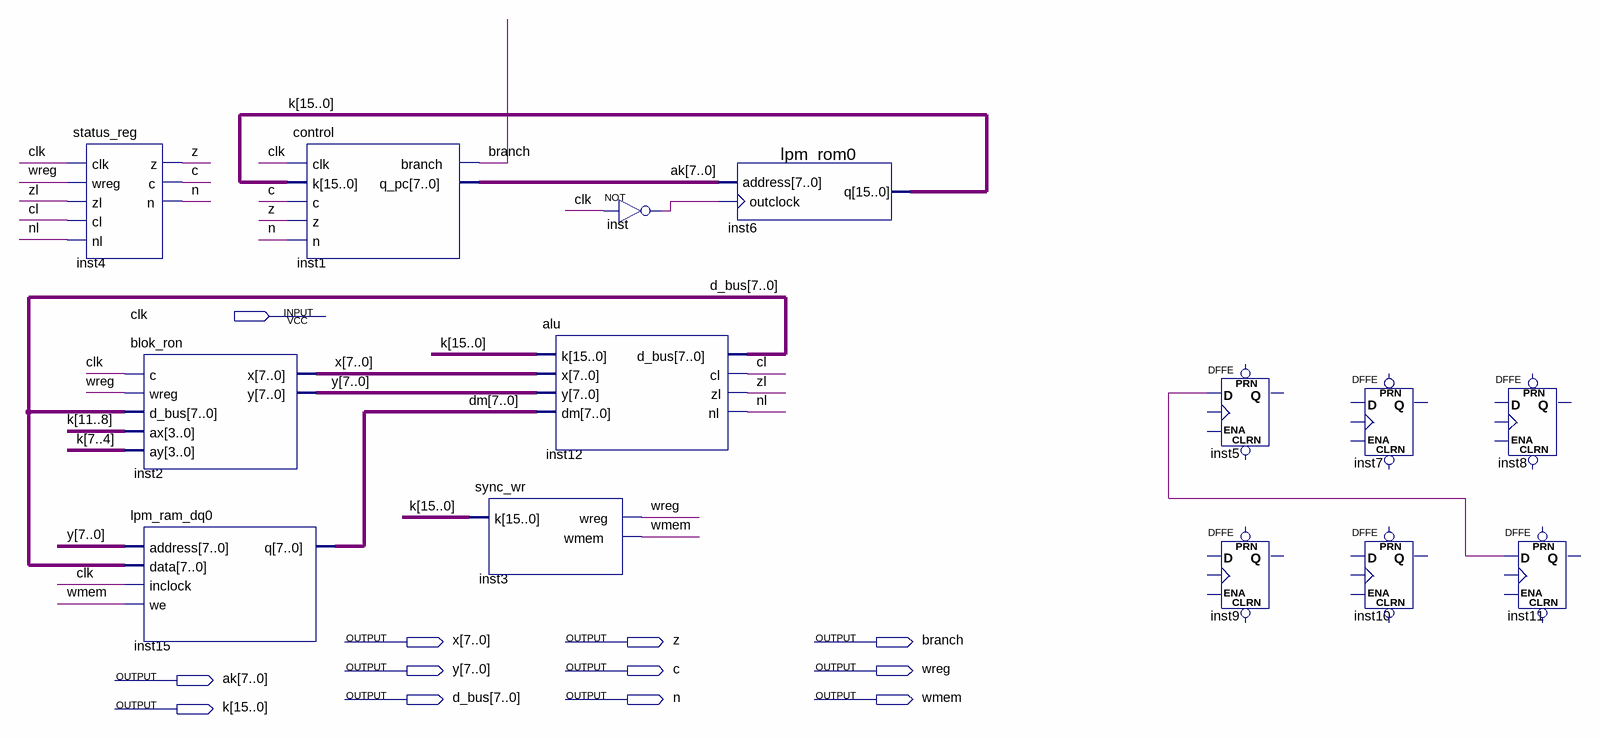
[diagram p0: schematic sheet]
// Quartus schematic cpu.bdf as structural Verilog: 14 symbols, 12 pins
module cpu (
  input  clk,
  output [7:0] x,
  output z,
  output branch,
  output [7:0] y,
  output c,
  output wreg,
  output [7:0] ak,
  output [7:0] d_bus,
  output n,
  output wmem,
  output [15:0] k
);

  wire cl, inst_out, nl, undriven, zl;
  wire [7:0] dm;

  status_reg inst4 (.clk(clk), .wreg(wreg), .zl(zl), .cl(cl), .nl(nl), .z(z), .c(c), .n(n));
  blok_ron inst2 (.c(clk), .wreg(wreg), .d_bus(d_bus), .ax(k[11:8]), .ay(k[7:4]), .x(x), .y(y));
  lpm_ram_dq0 inst15 (.address(y), .data(d_bus), .inclock(clk), .we(wmem), .q(dm));
  control inst1 (.clk(clk), .k(k), .c(c), .z(z), .n(n), .branch(branch), .q_pc(ak));
  sync_wr inst3 (.k(k), .wreg(wreg), .wmem(wmem));
  alu inst12 (.k(k), .x(x), .y(y), .dm(dm), .d_bus(d_bus), .cl(cl), .zl(zl), .nl(nl));
  not inst (inst_out, clk);
  lpm_rom0 inst6 (.address(ak), .outclock(inst_out), .q(k));
  DFFE inst5 (.D(undriven));  // open: PRN, CLRN, CLK, ENA, Q
  DFFE inst9 ();  // open: PRN, CLRN, D, CLK, ENA, Q
  DFFE inst7 ();  // open: PRN, CLRN, D, CLK, ENA, Q
  DFFE inst10 ();  // open: PRN, CLRN, D, CLK, ENA, Q
  DFFE inst8 ();  // open: PRN, CLRN, D, CLK, ENA, Q
  DFFE inst11 (.D(undriven));  // open: PRN, CLRN, CLK, ENA, Q
endmodule
